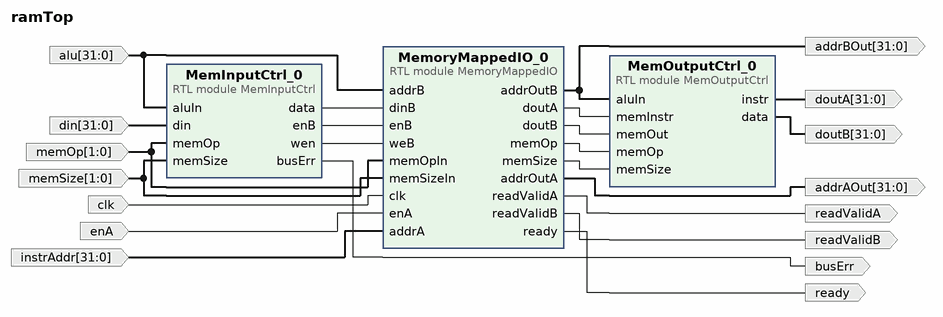
[diagram p0: block diagram of the top level]
# Vivado block design ramTop, xc7z007sclg400-1, Vivado 2023.1
create_bd_design ramTop

create_bd_port -dir O -from 31 -to 0 addrAOut
create_bd_port -dir O -from 31 -to 0 addrBOut
create_bd_port -dir I -from 31 -to 0 alu
create_bd_port -dir I clk
create_bd_port -dir I -from 31 -to 0 din
create_bd_port -dir O -from 31 -to 0 doutA
create_bd_port -dir O -from 31 -to 0 doutB
create_bd_port -dir I enA
create_bd_port -dir I -from 31 -to 0 instrAddr
create_bd_port -dir I -from 1 -to 0 memOp
create_bd_port -dir I -from 1 -to 0 memSize
create_bd_port -dir O readValidA
create_bd_port -dir O readValidB
create_bd_port -dir O ready
create_bd_port -dir O busErr

create_bd_cell -type module -reference MemInputCtrl MemInputCtrl_0
create_bd_cell -type module -reference MemOutputCtrl MemOutputCtrl_0
create_bd_cell -type module -reference MemoryMappedIO MemoryMappedIO_0

# ---- connections ----

connect_bd_net [get_bd_pins MemInputCtrl_0/busErr] [get_bd_ports busErr]
connect_bd_net [get_bd_pins MemInputCtrl_0/data] [get_bd_pins MemoryMappedIO_0/dinB]
connect_bd_net [get_bd_pins MemInputCtrl_0/enB] [get_bd_pins MemoryMappedIO_0/enB]
connect_bd_net [get_bd_pins MemInputCtrl_0/wen] [get_bd_pins MemoryMappedIO_0/weB]
connect_bd_net [get_bd_pins MemOutputCtrl_0/data] [get_bd_ports doutB]
connect_bd_net [get_bd_pins MemOutputCtrl_0/instr] [get_bd_ports doutA]
connect_bd_net [get_bd_pins MemoryMappedIO_0/addrOutA] [get_bd_ports addrAOut]
connect_bd_net [get_bd_pins MemoryMappedIO_0/addrOutB] [get_bd_ports addrBOut] [get_bd_pins MemOutputCtrl_0/aluIn]
connect_bd_net [get_bd_pins MemoryMappedIO_0/doutA] [get_bd_pins MemOutputCtrl_0/memInstr]
connect_bd_net [get_bd_pins MemoryMappedIO_0/doutB] [get_bd_pins MemOutputCtrl_0/memOut]
connect_bd_net [get_bd_pins MemoryMappedIO_0/memOp] [get_bd_pins MemOutputCtrl_0/memOp]
connect_bd_net [get_bd_pins MemoryMappedIO_0/memSize] [get_bd_pins MemOutputCtrl_0/memSize]
connect_bd_net [get_bd_pins MemoryMappedIO_0/readValidA] [get_bd_ports readValidA]
connect_bd_net [get_bd_pins MemoryMappedIO_0/readValidB] [get_bd_ports readValidB]
connect_bd_net [get_bd_pins MemoryMappedIO_0/ready] [get_bd_ports ready]
connect_bd_net [get_bd_ports alu] [get_bd_pins MemInputCtrl_0/aluIn] [get_bd_pins MemoryMappedIO_0/addrB]
connect_bd_net [get_bd_ports clk] [get_bd_pins MemoryMappedIO_0/clk]
connect_bd_net [get_bd_ports din] [get_bd_pins MemInputCtrl_0/din]
connect_bd_net [get_bd_ports enA] [get_bd_pins MemoryMappedIO_0/enA]
connect_bd_net [get_bd_ports instrAddr] [get_bd_pins MemoryMappedIO_0/addrA]
connect_bd_net [get_bd_ports memOp] [get_bd_pins MemInputCtrl_0/memOp] [get_bd_pins MemoryMappedIO_0/memOpIn]
connect_bd_net [get_bd_ports memSize] [get_bd_pins MemInputCtrl_0/memSize] [get_bd_pins MemoryMappedIO_0/memSizeIn]

validate_bd_design
save_bd_design
